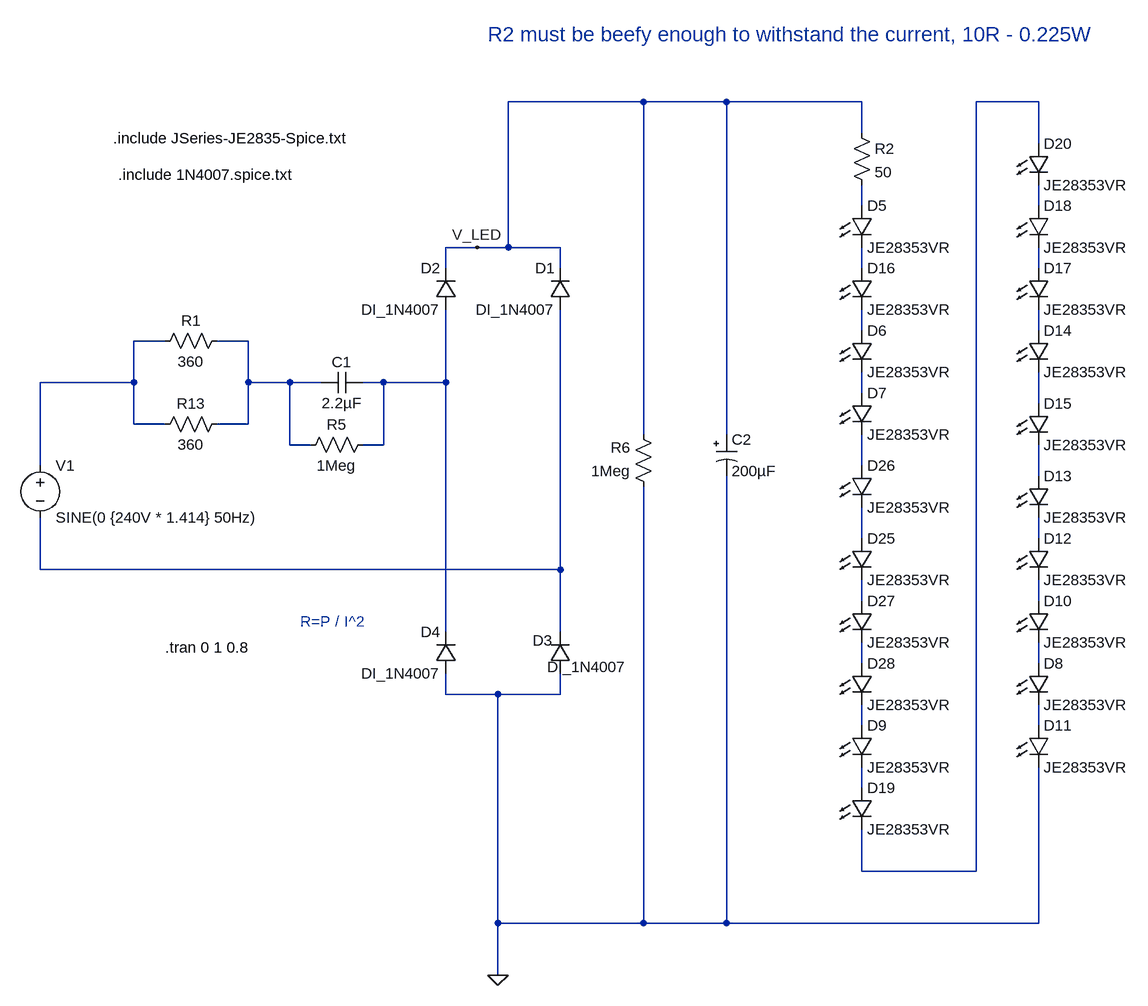
[diagram p0: schematic led_ring_220.asc]
led_ring_220.asc, the LTspice schematic file:
Version 4
SHEET 1 2404 932
WIRE 448 -432 240 -432
WIRE 576 -432 448 -432
WIRE 784 -432 576 -432
WIRE 1056 -432 960 -432
WIRE 784 -384 784 -432
WIRE 1056 -368 1056 -432
WIRE 784 -272 784 -304
WIRE 1056 -272 1056 -304
WIRE 192 -208 144 -208
WIRE 240 -208 240 -432
WIRE 240 -208 192 -208
WIRE 320 -208 240 -208
WIRE 144 -176 144 -208
WIRE 320 -176 320 -208
WIRE 784 -176 784 -208
WIRE 1056 -176 1056 -208
WIRE 784 -80 784 -112
WIRE 1056 -80 1056 -112
WIRE -288 -64 -336 -64
WIRE -160 -64 -208 -64
WIRE -336 0 -336 -64
WIRE -336 0 -480 0
WIRE -160 0 -160 -64
WIRE -96 0 -160 0
WIRE -48 0 -96 0
WIRE 48 0 16 0
WIRE 144 0 144 -112
WIRE 144 0 48 0
WIRE 784 16 784 -16
WIRE 1056 32 1056 -16
WIRE -336 64 -336 0
WIRE -288 64 -336 64
WIRE -160 64 -160 0
WIRE -160 64 -208 64
WIRE 448 80 448 -432
WIRE 576 80 576 -432
WIRE -96 96 -96 0
WIRE -64 96 -96 96
WIRE 48 96 48 0
WIRE 48 96 16 96
WIRE -480 128 -480 0
WIRE 784 128 784 80
WIRE 1056 144 1056 96
WIRE 784 240 784 192
WIRE 1056 240 1056 208
WIRE -480 288 -480 208
WIRE 320 288 320 -112
WIRE 320 288 -480 288
WIRE 784 336 784 304
WIRE 1056 336 1056 304
WIRE 144 384 144 0
WIRE 320 384 320 288
WIRE 784 432 784 400
WIRE 1056 432 1056 400
WIRE 144 480 144 448
WIRE 224 480 144 480
WIRE 320 480 320 448
WIRE 320 480 224 480
WIRE 784 528 784 496
WIRE 1056 528 1056 496
WIRE 784 624 784 592
WIRE 784 752 784 688
WIRE 960 752 960 -432
WIRE 960 752 784 752
WIRE 224 832 224 480
WIRE 448 832 448 160
WIRE 448 832 224 832
WIRE 576 832 576 144
WIRE 576 832 448 832
WIRE 1056 832 1056 592
WIRE 1056 832 576 832
WIRE 224 912 224 832
FLAG 224 912 0
FLAG 192 -208 V_LED
SYMBOL diode 336 -112 R180
WINDOW 0 24 64 Left 2
WINDOW 3 24 0 Left 2
SYMATTR InstName D1
SYMATTR Value DI_1N4007
SYMBOL diode 160 -112 R180
WINDOW 0 24 64 Left 2
WINDOW 3 24 0 Left 2
SYMATTR InstName D2
SYMATTR Value DI_1N4007
SYMBOL diode 336 448 R180
WINDOW 0 28 51 Left 2
WINDOW 3 -86 10 Left 2
SYMATTR InstName D3
SYMATTR Value DI_1N4007
SYMBOL diode 160 448 R180
WINDOW 0 24 64 Left 2
WINDOW 3 24 0 Left 2
SYMATTR InstName D4
SYMATTR Value DI_1N4007
SYMBOL voltage -480 112 R0
WINDOW 123 0 0 Left 2
WINDOW 39 0 0 Left 2
SYMATTR InstName V1
SYMATTR Value SINE(0 {240V * 1.414} 50Hz)
SYMBOL LED 768 -176 R0
SYMATTR InstName D16
SYMATTR Value JE28353VR
SYMBOL LED 768 -80 R0
SYMATTR InstName D6
SYMATTR Value JE28353VR
SYMBOL LED 768 16 R0
SYMATTR InstName D7
SYMATTR Value JE28353VR
SYMBOL LED 768 240 R0
SYMATTR InstName D25
SYMATTR Value JE28353VR
SYMBOL LED 768 128 R0
SYMATTR InstName D26
SYMATTR Value JE28353VR
SYMBOL LED 768 336 R0
SYMATTR InstName D27
SYMATTR Value JE28353VR
SYMBOL LED 768 432 R0
SYMATTR InstName D28
SYMATTR Value JE28353VR
SYMBOL cap 16 -16 R90
WINDOW 0 0 32 VBottom 2
WINDOW 3 32 32 VTop 2
SYMATTR InstName C1
SYMATTR Value 2.2µF
SYMATTR SpiceLine V=400
SYMBOL LED 1040 336 R0
SYMATTR InstName D10
SYMATTR Value JE28353VR
SYMBOL LED 1040 240 R0
SYMATTR InstName D12
SYMATTR Value JE28353VR
SYMBOL LED 1040 144 R0
SYMATTR InstName D13
SYMATTR Value JE28353VR
SYMBOL LED 1040 -80 R0
SYMATTR InstName D14
SYMATTR Value JE28353VR
SYMBOL LED 1040 32 R0
SYMATTR InstName D15
SYMATTR Value JE28353VR
SYMBOL LED 1040 -176 R0
SYMATTR InstName D17
SYMATTR Value JE28353VR
SYMBOL LED 1040 -272 R0
SYMATTR InstName D18
SYMATTR Value JE28353VR
SYMBOL LED 768 -272 R0
SYMATTR InstName D5
SYMATTR Value JE28353VR
SYMBOL LED 1040 432 R0
SYMATTR InstName D8
SYMATTR Value JE28353VR
SYMBOL res 768 -400 R0
SYMATTR InstName R2
SYMATTR Value 50
SYMATTR SpiceLine tol=1 pwr=2
SYMBOL polcap 560 80 R0
SYMATTR InstName C2
SYMATTR Value 200µF
SYMATTR SpiceLine V=100
SYMBOL res 32 80 R90
WINDOW 0 0 56 VBottom 2
WINDOW 3 32 56 VTop 2
SYMATTR InstName R5
SYMATTR Value 1Meg
SYMBOL res 464 176 R180
WINDOW 0 36 76 Left 2
WINDOW 3 36 40 Left 2
SYMATTR InstName R6
SYMATTR Value 1Meg
SYMBOL res -192 48 R90
WINDOW 0 0 56 VBottom 2
WINDOW 3 32 56 VTop 2
SYMATTR InstName R13
SYMATTR Value 360
SYMATTR SpiceLine tol=1 pwr=2
SYMBOL res -192 -80 R90
WINDOW 0 0 56 VBottom 2
WINDOW 3 32 56 VTop 2
SYMATTR InstName R1
SYMATTR Value 360
SYMATTR SpiceLine tol=1 pwr=2
SYMBOL LED 768 528 R0
SYMATTR InstName D9
SYMATTR Value JE28353VR
SYMBOL LED 1040 528 R0
SYMATTR InstName D11
SYMATTR Value JE28353VR
SYMBOL LED 768 624 R0
SYMATTR InstName D19
SYMATTR Value JE28353VR
SYMBOL LED 1040 -368 R0
SYMATTR InstName D20
SYMATTR Value JE28353VR
TEXT -288 408 Left 2 !.tran 0 1 0.8
TEXT -80 368 Left 2 ;R=P / I^2
TEXT -368 -376 Left 2 !.include JSeries-JE2835-Spice.txt
TEXT -360 -320 Left 2 !.include 1N4007.spice.txt
TEXT 208 -536 Left 3 ;R2 must be beefy enough to withstand the current, 10R - 0.225W

The netlist it stands for:
* led_ring_220.asc
D1 N017 V_LED DI_1N4007
D2 N010 V_LED DI_1N4007
D3 0 N017 DI_1N4007
D4 0 N010 DI_1N4007
V1 N008 N017 SINE(0 {240V * 1.414} 50Hz)
D16 N004 N006 JE28353VR
D6 N006 N011 JE28353VR
D7 N011 N013 JE28353VR
D25 N015 N018 JE28353VR
D26 N013 N015 JE28353VR
D27 N018 N020 JE28353VR
D28 N020 N022 JE28353VR
C1 N010 N009 2.2µF V=400
D10 N019 N021 JE28353VR
D12 N016 N019 JE28353VR
D13 N014 N016 JE28353VR
D14 N007 N012 JE28353VR
D15 N012 N014 JE28353VR
D17 N005 N007 JE28353VR
D18 N003 N005 JE28353VR
D5 N002 N004 JE28353VR
D8 N021 N023 JE28353VR
R2 V_LED N002 50 tol=1 pwr=2
C2 V_LED 0 200µF V=100
R5 N010 N009 1Meg
R6 0 V_LED 1Meg
R13 N009 N008 360 tol=1 pwr=2
R1 N009 N008 360 tol=1 pwr=2
D9 N022 N024 JE28353VR
D11 N023 0 JE28353VR
D19 N024 N001 JE28353VR
D20 N001 N003 JE28353VR
.model D D
.lib standard.dio
.tran 0 1 0.8
* R=P / I^2
.include JSeries-JE2835-Spice.txt
.include 1N4007.spice.txt
* R2 must be beefy enough to withstand the current, 10R - 0.225W
.backanno
.end